# EAGLE design mPEXternalizer (EAGLE 6.5.0)
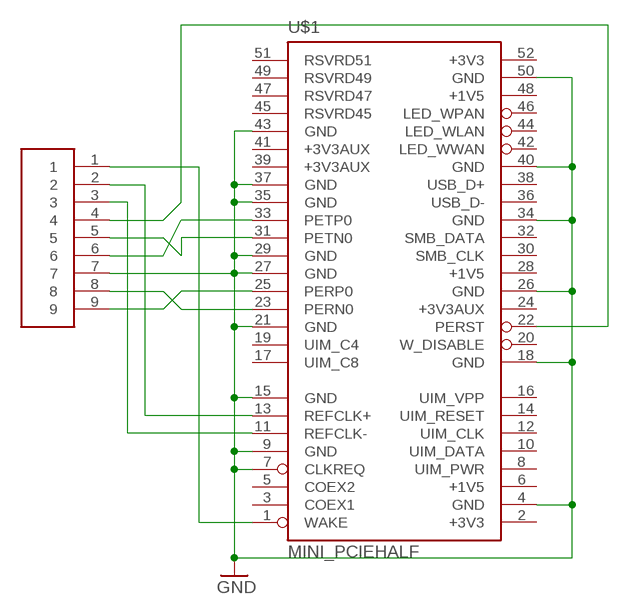
[diagram p0: schematic, sheet 1]

## Parts
U$1  MINI_PCIEHALF  [MINI_PCIE_HALF]
U$2  USB3FLAT  [USB3_FLAT]

## Nets
CK_N: U$1.11(REFCLK-) U$2.3
CK_P: U$1.13(REFCLK+) U$2.2
GND: U$1.4(GND) U$1.7(CLKREQ) U$1.9(GND) U$1.15(GND) U$1.18(GND) U$1.21(GND) U$1.26(GND) U$1.27(GND) U$1.29(GND) U$1.34(GND) U$1.35(GND) U$1.37(GND) U$1.40(GND) U$1.43(GND) U$1.50(GND) U$2.7
N$9: U$1.1(WAKE) U$2.1
N$10: U$1.22(PERST) U$2.4
RX_N: U$1.25(PERP0) U$2.9
RX_P: U$1.23(PERN0) U$2.8
TX_N: U$1.31(PETN0) U$2.5
TX_P: U$1.33(PETP0) U$2.6
Unconnected: U$1.3(COEX1) U$1.5(COEX2) U$1.8(UIM_PWR) U$1.10(UIM_DATA) U$1.12(UIM_CLK) U$1.14(UIM_RESET) U$1.16(UIM_VPP) U$1.17(UIM_C8) U$1.19(UIM_C4) U$1.20(W_DISABLE) U$1.30(SMB_CLK) U$1.36(USB_D-) U$1.39(+3V3AUX) U$1.41(+3V3AUX) U$1.42(LED_WWAN) U$1.44(LED_WLAN) U$1.45(RSVRD45) U$1.46(LED_WPAN) U$1.47(RSVRD47) U$1.48(+1V5) U$1.49(RSVRD49) U$1.51(RSVRD51)

## Power pins joined to a net without a drawn wire
+1V5: U$1.6(+1V5) U$1.28(+1V5)
+3V3: U$1.2(+3V3) U$1.52(+3V3)
+3V3AUX: U$1.24(+3V3AUX)
GND: U$1.HOLE1B(GND) U$1.HOLE1T(GND) U$1.HOLE2B(GND) U$1.HOLE2T(GND)
SMB_DATA: U$1.32(SMB_DATA)
USB_D+: U$1.38(USB_D+)

## Library data of the parts
U$1 = con-heo.mini_pci_express:MINI_PCIE
U$2 = con-pci_express%28pci-e%29:USB3

## Board
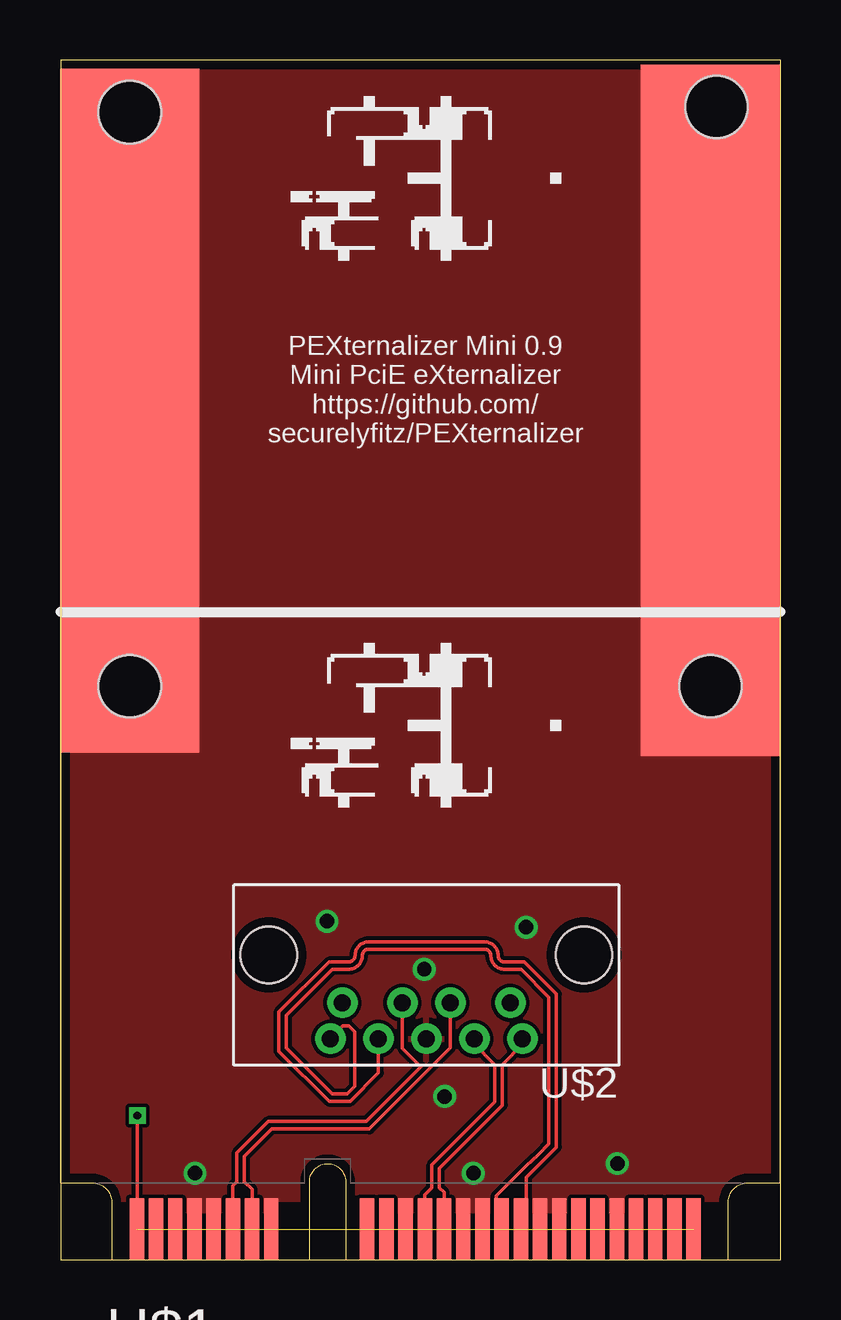
[diagram p1: board, top side]
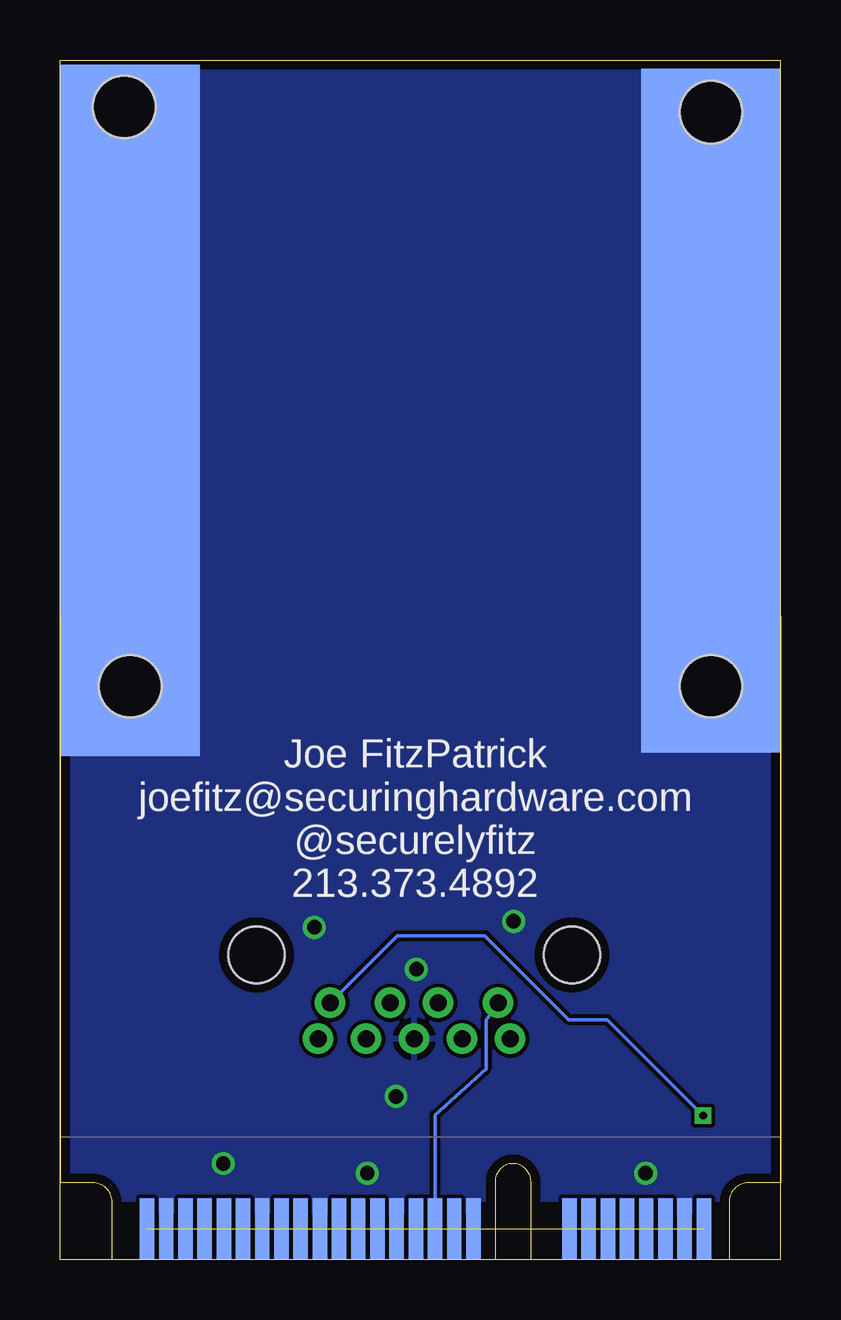
[diagram p2: board, bottom side, seen from below]

Size 30.02 x 50.01 mm. Coordinates in mm from the lower left corner, seen from the top.
Outline: 0.03,0 30.02,0 30.02,50.01 0.03,50.01 0.03,0
Copper layers (1*16): Top 0.0356mm / dielectric 1.5011mm / Bottom 0.0356mm
Design rules "LaenPCBOrder": minimum track width 6mil, minimum drill 13mil, track to track 6mil, track to pad 6mil, pad to pad 6mil, via to via 6mil, smd to smd 6mil, copper to edge 15mil, drill to drill 6mil, minimum pad ring 7mil, minimum via ring 7mil, stop-mask expansion 3mil, vias tented up to drill 0mil, thermal gap 10mil

### Footprints (pad centres in the part's own frame; a part is rotated, then mirrored left to right if it is on the bottom)
MINI_PCIE_HALF = smd 0.6 x 2.55: 1 0,0; 3 0.8,0; 5 1.6,0; 7 2.4,0; 9 3.2,0; 11 4,0; 13 4.8,0; 15 5.6,0; 17 9.6,0; 19 10.4,0; 21 11.2,0; 23 12,0; 25 12.8,0; 27 13.6,0; 29 14.4,0; 31 15.2,0; 33 16,0; 35 16.8,0; 37 17.6,0; 39 18.4,0; 41 19.2,0; 43 20,0; 45 20.8,0; 47 21.6,0; 49 22.4,0; 51 23.2,0 | smd 0.6 x 2.55 bottom: 2 0,0; 4 0.8,0; 6 1.6,0; 8 2.4,0; 10 3.2,0; 12 4,0; 14 4.8,0; 16 5.6,0; 18 9.6,0; 20 10.4,0; 22 11.2,0; 24 12,0; 26 12.8,0; 28 13.6,0; 30 14.4,0; 32 15.2,0; 34 16,0; 36 16.8,0; 38 17.6,0; 40 18.4,0; 42 19.2,0; 44 20,0; 46 20.8,0; 48 21.6,0; 50 22.4,0; 52 23.2,0 | smd 5.8 x 28.5 bottom: HOLE1B -0.3,34.125 | smd 5.8 x 28.5: HOLE1T -0.3,34.125 | smd 5.8 x 28.8 bottom: HOLE2B 23.9,34.125 | smd 5.8 x 28.8: HOLE2T 23.9,34.125 | hole 2.6: -0.3,22.625; 23.9,22.625; -0.3,46.557; 24.15,46.775
USB3_FLAT = drill 0.7 pad 1.27: 1 -3.5,2; 2 -1,2; 3 1,2; 4 3.5,2; 5 4,3.5; 6 2,3.5; 7 0,3.5; 8 -2,3.5; 9 -4,3.5 | hole 2.35: -6.57,0; 6.57,0

### Placement (x,y rotation side)
U$1  3.2,1.27 0 top
U$2  15.27,12.7 180 top
U$3  [SH-HALFINCH]  9.22,18 0 top
U$4  [SH-HALFINCH]  9.22,40.8 0 top

### Tracks (layer width: path | path; a pad name or v marks a point on that pad's centre or on a via)
+1V5  (1 unrouted)
+3V3  (1 unrouted)
CK_N
  Top 0.152: U$1.11 7.2,3.08 7.37,3.25 7.37,4.44 8.69,5.76 12.76,5.76 15.04,8.04 14.27,8.81 U$2.3
CK_P
  Top 0.152: U$1.13 8,2.93 7.68,3.25 7.68,4.32 8.81,5.45 12.89,5.45 16.27,8.83 U$2.2
GND  (via drill 0.6)
  other vias: 16.02,6.8 17.23,3.6 5.62,3.6 23.23,4 19.42,13.86 11.12,14.11 15.18,12.11
  pour Bottom (rank 4): 0.03,2 30.02,2 30.02,50.01 0.03,50.01
  pour Top (rank 4): 0.03,2 30.02,2 30.02,50.01 0.03,50.01
N$9  (via drill 0.33)
  Top 0.152: U$1.1 3.23,1.3 v3.23,6
  Bottom 0.152: v3.23,6 7.23,10 8.83,10 12.33,13.5 15.96,13.5 U$2.1
N$10
  Bottom 0.152: U$1.22 14.4,6.03 12.28,7.96 12.28,10 U$2.4
RX_N
  Top 0.152: U$2.9 19.27,8.97 18.43,8.13 18.43,6.44 15.8,3.82 15.8,3 16,2.81 U$1.25
RX_P
  Top 0.152: U$2.8 17.27,8.99 18.12,8.13 18.12,6.57 15.5,3.94 15.5,3 15.2,2.71 U$1.23
TX_N
  Top 0.152: U$1.31 18.17,1.5 18.17,2.65 19.43,3.91 19.92,4.36 20.37,4.82 20.37,10.94 19.21,12.1 18.52,12.1 arc-90 17.95,12.67 arc90 17.69,12.94 12.86,12.94 arc90 12.6,12.67 arc-90 12.03,12.1 11.34,12.1 9.43,10.19 9.43,8.82 11.34,6.91 11.96,6.91 12.28,7.22 12.28,9.5 12.03,9.75 11.78,9.75 11.27,9.25 U$2.5
TX_P
  Top 0.152: U$1.33 19.2,1.78 19.42,2 19.42,3.44 20.68,4.69 20.68,11.07 19.34,12.41 18.52,12.41 arc-90 18.26,12.67 arc90 17.69,13.25 12.86,13.25 arc90 12.29,12.67 arc-90 12.03,12.41 11.21,12.41 9.12,10.32 9.12,8.69 11.21,6.6 12.09,6.6 13.27,7.78 U$2.6

### Text on the board
tPlace: PEXternalizer Mini 0.9 / Mini PciE eXternalizer / https://github.com/ / securelyfitz/PEXternalizer
bPlace: Joe FitzPatrick / joefitz@securinghardware.com / @securelyfitz / 213.373.4892
tStop: PEXternalizer Mini 0.9